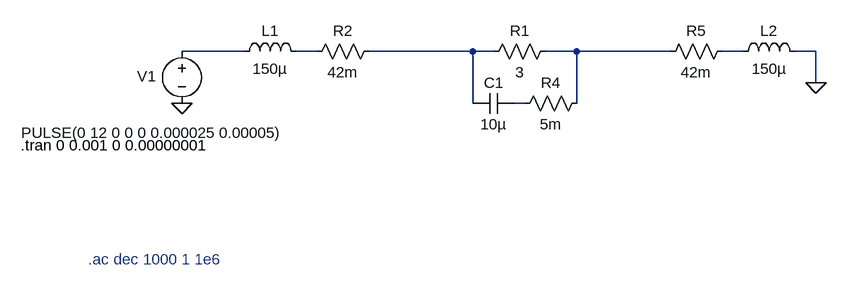
[diagram p0: schematic TEC_Driver_4A.asc]
TEC_Driver_4A.asc, the LTspice schematic file:
Version 4
SHEET 1 1076 820
WIRE 80 128 -16 128
WIRE 192 128 160 128
WIRE 432 128 272 128
WIRE 464 128 432 128
WIRE 592 128 544 128
WIRE 736 128 592 128
WIRE 848 128 816 128
WIRE 960 128 928 128
WIRE 960 176 960 128
WIRE 432 208 432 128
WIRE 512 208 496 208
WIRE 592 208 592 128
FLAG 960 176 0
FLAG -16 208 0
SYMBOL ind 64 144 R270
WINDOW 0 32 56 VTop 2
WINDOW 3 5 56 VBottom 2
SYMATTR InstName L1
SYMATTR Value 150µ
SYMBOL ind 832 144 R270
WINDOW 0 32 56 VTop 2
WINDOW 3 5 56 VBottom 2
SYMATTR InstName L2
SYMATTR Value 150µ
SYMBOL res 448 144 R270
WINDOW 0 32 56 VTop 2
WINDOW 3 0 56 VBottom 2
SYMATTR InstName R1
SYMATTR Value 3
SYMBOL voltage -16 112 R0
WINDOW 3 -247 141 Left 2
WINDOW 123 -69 82 Left 2
WINDOW 39 0 0 Left 0
WINDOW 0 -69 54 Left 2
SYMATTR Value PULSE(0 12 0 0 0 0.000025 0.00005)
SYMATTR InstName V1
SYMBOL res 288 112 R90
WINDOW 0 0 56 VBottom 2
WINDOW 3 32 56 VTop 2
SYMATTR InstName R2
SYMATTR Value 42m
SYMBOL res 832 112 R90
WINDOW 0 0 56 VBottom 2
WINDOW 3 32 56 VTop 2
SYMATTR InstName R5
SYMATTR Value 42m
SYMBOL cap 496 192 R90
WINDOW 0 0 32 VBottom 2
WINDOW 3 32 32 VTop 2
SYMATTR InstName C1
SYMATTR Value 10µ
SYMBOL res 608 192 R90
WINDOW 0 0 56 VBottom 2
WINDOW 3 32 56 VTop 2
SYMATTR InstName R4
SYMATTR Value 5m
TEXT -264 272 Left 2 !.tran 0 0.001 0 0.00000001
TEXT -160 448 Left 2 ;.ac dec 1000 1 1e6

The netlist it stands for:
* TEC_Driver_4A.asc
L1 N001 N002 150µ
L2 N005 0 150µ
R1 N003 N004 3
V1 N001 0 PULSE(0 12 0 0 0 0.000025 0.00005)
R2 N003 N002 42m
R5 N005 N004 42m
C1 N006 N003 10µ
R4 N004 N006 5m
.tran 0 0.001 0 0.00000001
* .ac dec 1000 1 1e6
.backanno
.end